# EAGLE design v2 4 button (EAGLE 9.6.2)
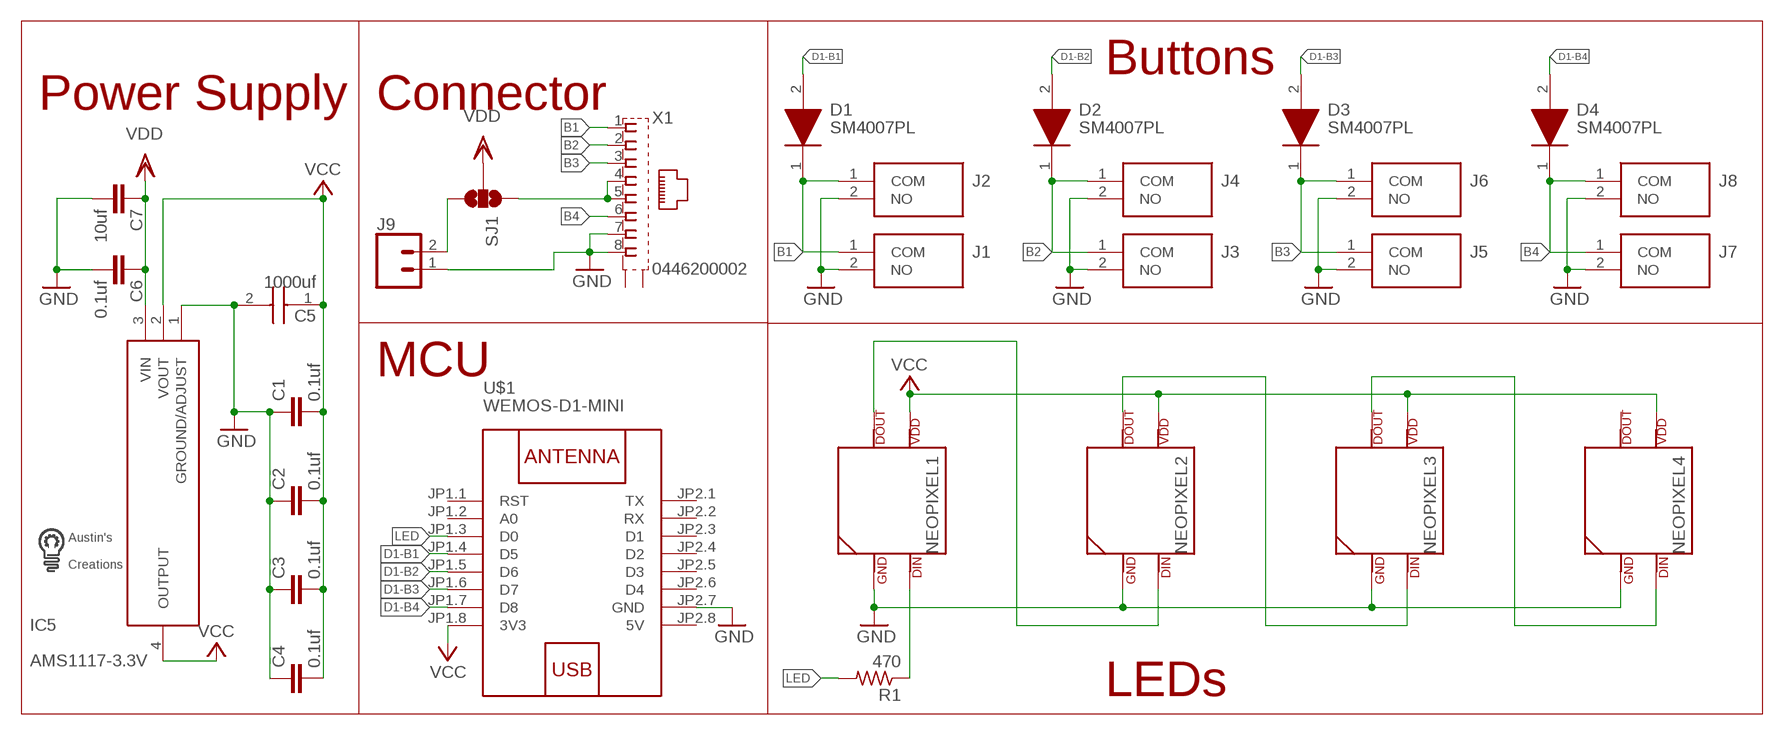
[diagram p0: schematic, sheet 1]

## Parts
C1  0.1uf  C-EUC0603  [C0603]
C2  0.1uf  C-EUC0603  [C0603]
C3  0.1uf  C-EUC0603  [C0603]
C4  0.1uf  C-EUC0603  [C0603]
C5  1000uf  EEE-0JA102P  [CAPAE1030X1050N]
C6  0.1uf  C-EUC0603  [C0603]
C7  10uf  C-EUC0603  [C0603]
D1  SM4007PL  [SODFL3718X125N]
D2  SM4007PL  [SODFL3718X125N]
D3  SM4007PL  [SODFL3718X125N]
D4  SM4007PL  [SODFL3718X125N]
IC5  AMS1117-3.3V  [SOT229P700X180-4N]
J1  PTS636_SM25F_SMTR_LFS  [PTS636SM25FSMTRLFS]
J2  PTS636_SM25F_SMTR_LFS  [PTS636SM25FSMTRLFS]
J3  PTS636_SM25F_SMTR_LFS  [PTS636SM25FSMTRLFS]
J4  PTS636_SM25F_SMTR_LFS  [PTS636SM25FSMTRLFS]
J5  PTS636_SM25F_SMTR_LFS  [PTS636SM25FSMTRLFS]
J6  PTS636_SM25F_SMTR_LFS  [PTS636SM25FSMTRLFS]
J7  PTS636_SM25F_SMTR_LFS  [PTS636SM25FSMTRLFS]
J8  PTS636_SM25F_SMTR_LFS  [PTS636SM25FSMTRLFS]
J9  CONN_025MM  [SCREWTERMINAL-5MM-2]
NEOPIXEL1  SK6812NEOPIXEL5050  [SK6812]
NEOPIXEL2  SK6812NEOPIXEL5050  [SK6812]
NEOPIXEL3  SK6812NEOPIXEL5050  [SK6812]
NEOPIXEL4  SK6812NEOPIXEL5050  [SK6812]
R1  470  R-US_R0603  [R0603]
SJ1  SOLDERJUMPER_2WAYPASTE1&2  [SJ_3_PASTE1&2]
U$1  WEMOS-D1-MINI  [WEMOS-D1-MINI]
U$2  LOGO  [LOGO]
X1  0446200002  [0446200002]

## Nets
B1: D1.1(K) J1.1(COM) J2.1(COM) X1.1
B2: D2.1(K) J3.1(COM) J4.1(COM) X1.2
B3: D3.1(K) J5.1(COM) J6.1(COM) X1.3
B4: D4.1(K) J7.1(COM) J8.1(COM) X1.6
D1-B1: D1.2(A) U$1.JP1.4(D5)
D1-B2: D2.2(A) U$1.JP1.5(D6)
D1-B3: D3.2(A) U$1.JP1.6(D7)
D1-B4: D4.2(A) U$1.JP1.7(D8)
GND: C1.1 C2.1 C3.1 C4.1 C5.2(-) C6.2 C7.2 IC5.1(GROUND/ADJUST) J1.2(NO) J2.2(NO) J3.2(NO) J4.2(NO) J5.2(NO) J6.2(NO) J7.2(NO) J8.2(NO) J9.1 NEOPIXEL1.3(GND) NEOPIXEL2.3(GND) NEOPIXEL3.3(GND) NEOPIXEL4.3(GND) U$1.JP2.7(GND) X1.7 X1.8
LED: R1.2 U$1.JP1.3(D0)
N$1: NEOPIXEL1.2(DOUT) NEOPIXEL2.4(DIN)
N$2: NEOPIXEL2.2(DOUT) NEOPIXEL3.4(DIN)
N$3: NEOPIXEL3.2(DOUT) NEOPIXEL4.4(DIN)
N$4: SJ1.1 X1.4 X1.5
N$5: NEOPIXEL1.4(DIN) R1.1
N$6: J9.2 SJ1.3
VCC: C1.2 C2.2 C3.2 C4.2 C5.1(+) IC5.2(VOUT) IC5.4(OUTPUT) NEOPIXEL1.1(VDD) NEOPIXEL2.1(VDD) NEOPIXEL3.1(VDD) NEOPIXEL4.1(VDD) U$1.JP1.8(3V3)
VDD: C6.1 C7.1 IC5.3(VIN) SJ1.2
Unconnected: NEOPIXEL4.2(DOUT) U$1.JP1.1(RST) U$1.JP1.2(A0) U$1.JP2.1(TX) U$1.JP2.2(RX) U$1.JP2.3(D1) U$1.JP2.4(D2) U$1.JP2.5(D3) U$1.JP2.6(D4) X1.S@1(S1) X1.S@2(S2)

## Notes on the sheet
- Buttons
- Power Supply | Connector
- MCU
- LEDs

## Power pins joined to a net without a drawn wire
5V: U$1.JP2.8(5V)

## Library data of the parts
C1-C4 C6 C7 = rcl:C-EU: CAPACITOR, European symbol; SPICEPREFIX: C
C5 = SamacSys_Parts:EEE-0JA102P: Panasonic 1000uF 6.3 V Aluminium Electrolytic Capacitor G, S(V) Series 2000h 10 x 10.2mm Source: Datasheet <https://componentsearchengine.com/Datasheets/1/EEE-0JA102P.pdf>; DESCRIPTION: Panasonic 1000uF 6.3 V Aluminium Electrolytic Capacitor G, S(V) Series 2000h 10 x 10.2mm; HEIGHT: 10.5mm; MANUFACTURER_NAME: Panasonic; MANUFACTURER_PART_NUMBER: EEE-0JA102P; MOUSER_PART_NUMBER: 667-EEE-0JA102P; MOUSER_PRICE-STOCK: https://www.mouser.com/Search/Refine.aspx?Keyword=667-EEE-0JA102P
D1-D4 = SamacSys_Parts:SM4007PL: 1kV 1A 1.1V @ 1A SOD-123FL Diodes - General Purpose RoHS Source: Datasheet <https://datasheet.lcsc.com/szlcsc/1903051030_MDD-Jiangsu-Yutai-Elec-SM4007PL_C64898.pdf>; DESCRIPTION: 1kV 1A 1.1V @ 1A SOD-123FL Diodes - General Purpose RoHS; HEIGHT: 1.25mm; MANUFACTURER_NAME: MDD(Microdiode Electronics); MANUFACTURER_PART_NUMBER: SM4007PL
IC5 = SamacSys_Parts:AMS1117-3.3V: 1A LOW DROPOUT VOLTAGE REGULATOR, SOT-223 Source: Datasheet <http://www.advanced-monolithic.com/pdf/ds1117.pdf>; DESCRIPTION: 1A LOW DROPOUT VOLTAGE REGULATOR, SOT-223; HEIGHT: 1.8mm; MANUFACTURER_NAME: Advanced Monolithic Systems; MANUFACTURER_PART_NUMBER: ams1117-3.3v
J1-J8 = SamacSys_Parts:PTS636_SM25F_SMTR_LFS: Tactile Switches Tact 50mA 12VDC, 6.0x3.5, 2.5mm H, 180gf, F leads, No ground pin, White Actuator Source: Datasheet <https://ms.componentsearchengine.com/Datasheets/1/PTS636 SM25F SMTR LFS.pdf>; ARROW_PART_NUMBER: PTS636 SM25F SMTR LFS; ARROW_PRICE-STOCK: https://www.arrow.com/en/products/pts636-sm25f-smtr-lfs/ck; DESCRIPTION: Tactile Switches Tact 50mA 12VDC, 6.0x3.5, 2.5mm H, 180gf, F leads, No ground pin, White Actuator; HEIGHT: 2.7mm; MANUFACTURER_NAME: C & K COMPONENTS; MANUFACTURER_PART_NUMBER: PTS636 SM25F SMTR LFS; MOUSER_PART_NUMBER: 611-PTS636SM25FSMTRL; MOUSER_PRICE-STOCK: https://www.mouser.co.uk/ProductDetail/CK/PTS636-SM25F-SMTR-LFS?qs=vLWxofP3U2wcBTQSwfMFOw%3D%3D
J9 = SparkFun-Connectors:CONN_02: Multi connection point. Often used as Generic Header-pin footprint for 0.1 inch spaced/style header connections On any of the 0.1 inch spaced packages, you can populate with these: Break Away Headers - Straight <https://www.sparkfun.com/products/116> (PRT-00116) Break Away Male Headers - Right Angle <https://www.sparkfun.com/products/553> (PRT-00553) Female Headers <https://www.sparkfun.com/products/115> (PRT-00115) Break Away Headers - Machine Pin <https://www.sparkfun.com/products/117> (PRT-00117) Break Away Female Headers - Swiss Machine Pin <https://www.sparkfun.com/products/743> (PRT-00743) For SCREWTERMINALS and SPRING TERMINALS visit here: Screw Terimnals on SparkFun.com <https://www.sparkfun.com/search/results?term=Screw+Terminals> (5mm/3.5mm/2.54mm spacing) This device is also useful as a general connection point to wire up your design to another part of your project. Our various solder wires solder well into these plated through hole pads. Hook-Up Wire - Assortment (Stranded, 22 AWG) <https://www.sparkfun.com/products/11375> (PRT-11375) Hook-Up Wire - Assortment (Solid Core, 22 AWG) <https://www.sparkfun.com/products/11367> (PRT-11367) View the entire wire category on our website here <https://www.sparkfun.com/categories/141> Special notes: Molex polarized connector foot print use with: PRT-08233 with associated crimp pins and housings. 2.54_SCREWTERM for use with PRT-10571. 3.5mm Screw Terminal footprints for PRT-08084 5mm Screw Terminal footprints for use with PRT-08432; SF_SKU: PRT-08432
NEOPIXEL1-NEOPIXEL4 = custom parts:SK6812: for 5050 sk6812 LED
R1 = resistor:R-US_: RESISTOR, American symbol
SJ1 = SparkFun-Retired:SOLDERJUMPER_2WAY: Solder Jumper 2 way solder jumper
U$1 = diy-modules:WEMOS-D1-MINI: WEMOS D1 mini: Mini Wi-Fi Board based on ESP-8266 device More details can be found here: https://www.wemos.cc/product/d1-mini.html Click here to find device on ebay.com <http://www.ebay.com/sch/wemos+d1+mini+nodemcu>
U$2 = custom parts:LOGO
X1 = custom parts:0446200002: RJ-45 INVERTED MODULAR JACK ASSEMBLY WITH RJ-11 KEEPOUT FEATURE Source: Data sheet <http://www.farnell.com/datasheets/73207.pdf> MOLEX 0446200002 BUCHSE, RJ45, GESCHIRMT Source: Farnell <http://de.farnell.com/molex/0446200002/buchse-rj45-geschirmt/dp/9251910?ost=9251910>; MF: MOLEX; MPN: 0446200002; OC_FARNELL: 9251910

## Board
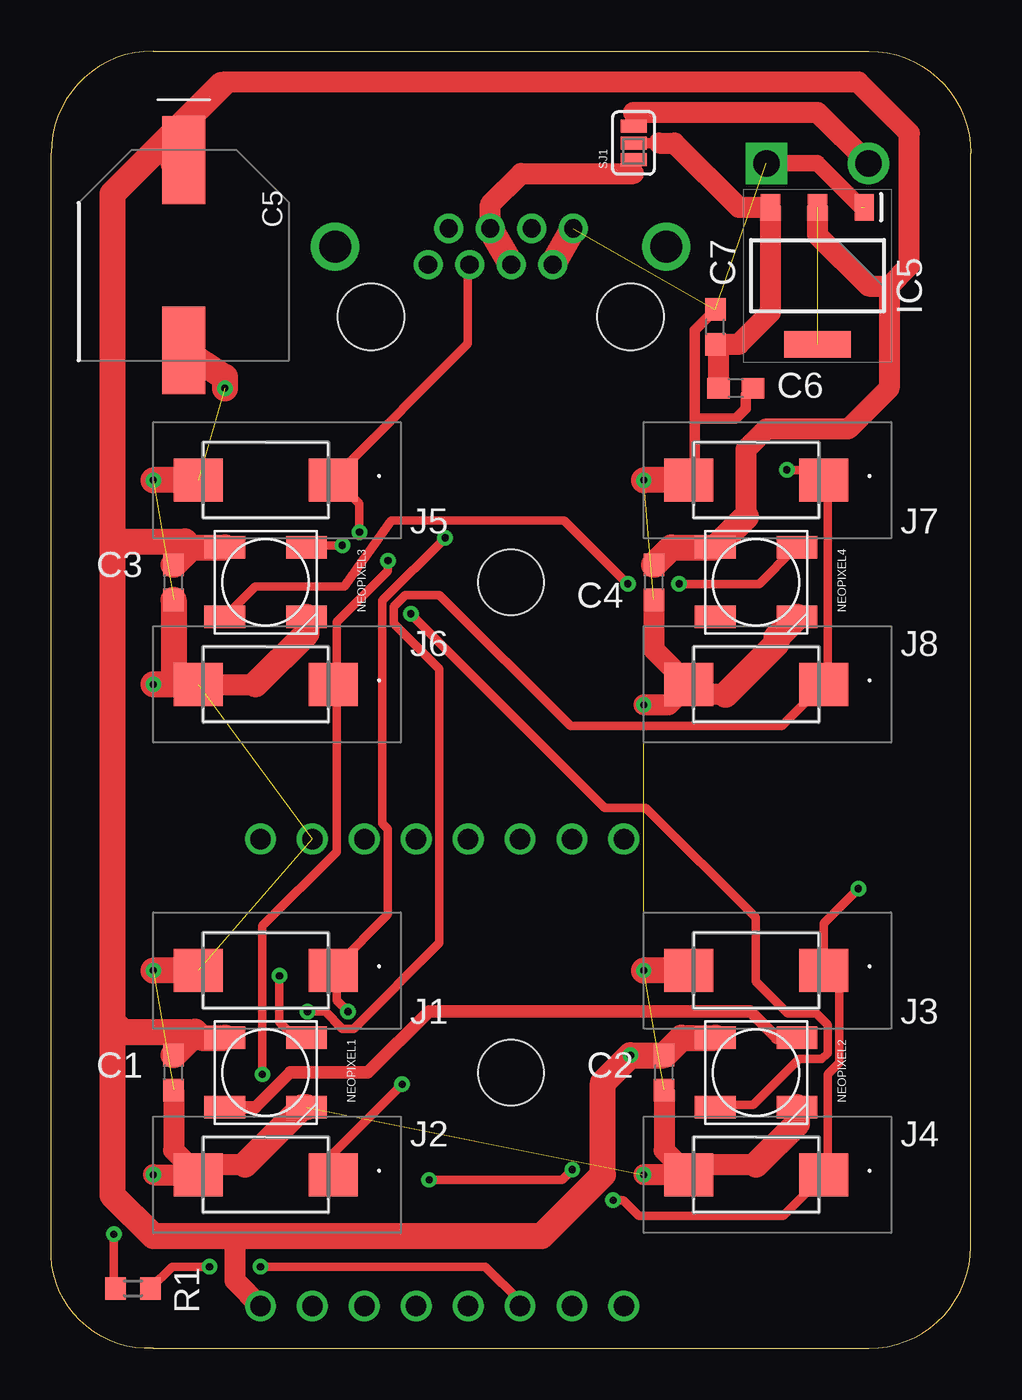
[diagram p1: board, top side]
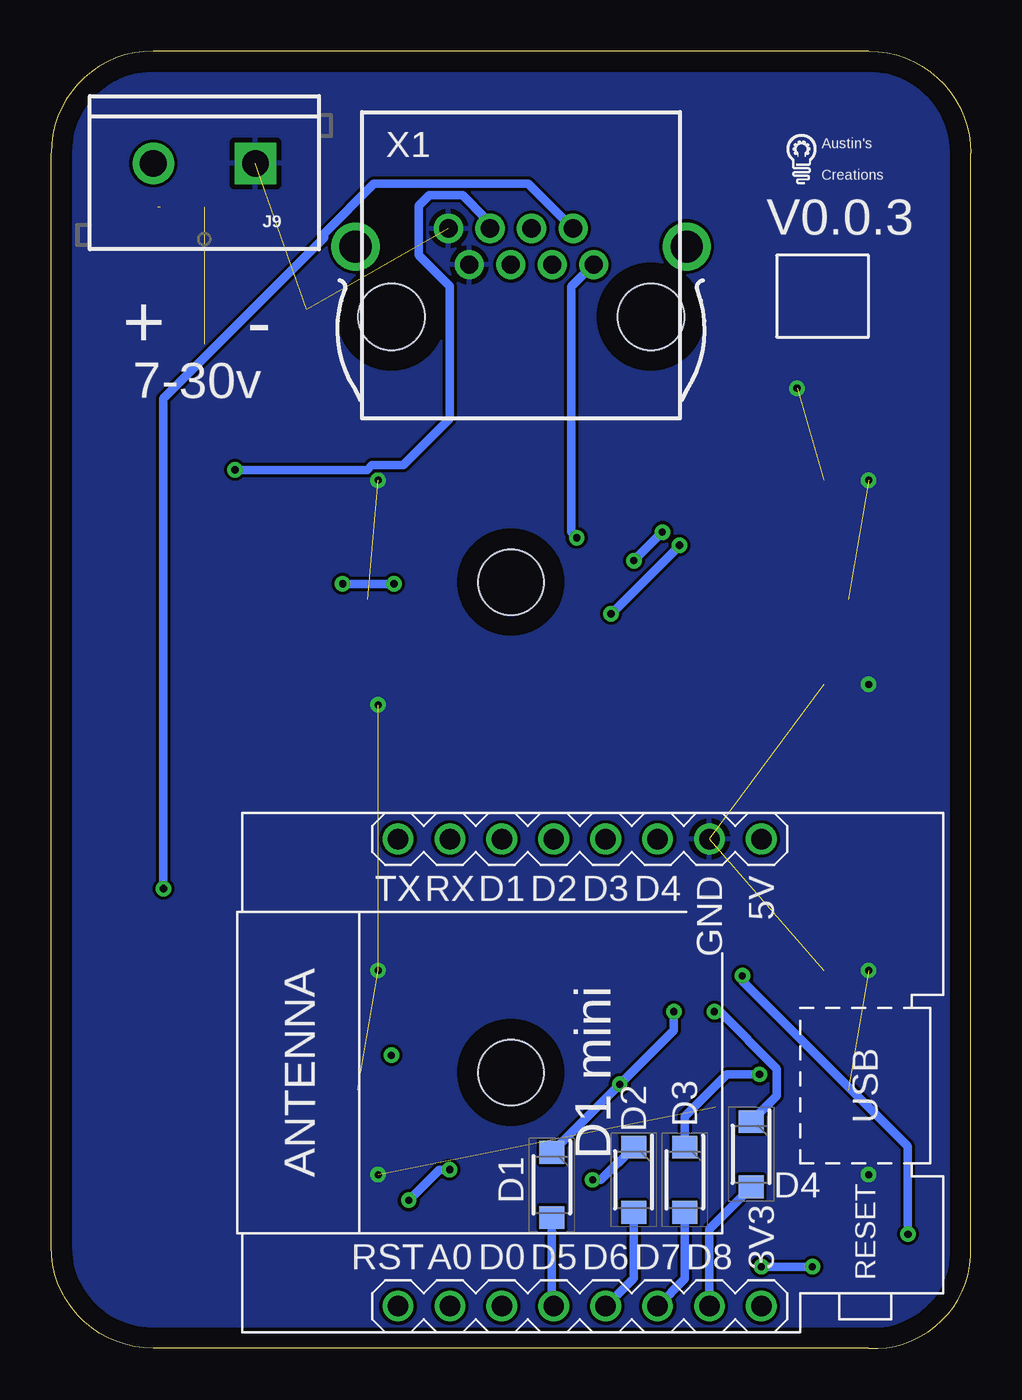
[diagram p2: board, bottom side, seen from below]

Size 45 x 63.5 mm. Coordinates in mm from the lower left corner, seen from the top.
Outline: 0,4.5 0,58.5 arc-90 5,63.5 40,63.5 arc-90 45,58.5 45,5 arc-90 40,0 5,0 arc-90 0,4.5
Copper layers (1*16): Top 0.035mm / dielectric 1.5mm / Bottom 0.035mm
Design rules "default *": minimum track width 16mil, minimum drill 0.35mm, track to track 6mil, track to pad 6mil, pad to pad 6mil, via to via 6mil, smd to smd 6mil, copper to edge 40mil, drill to drill 6mil, minimum pad ring 10mil, minimum via ring 8mil, stop-mask expansion 4mil, vias tented up to drill 0mil, thermal gap 10mil
Holes 3.2 mm at 22.5,37.5 22.5,13.5

### Footprints (pad centres in the part's own frame; a part is rotated, then mirrored left to right if it is on the bottom)
C0603 = smd 1.1 x 1: 1 -0.85,0; 2 0.85,0
CAPAE1030X1050N = smd 4.3 x 2.1: 1 -4.65,0; 2 4.65,0
SODFL3718X125N = smd 1.12 x 1.22: 1 -1.6,0; 2 1.6,0
SOT229P700X180-4N = smd 1.3 x 0.95: 1 -3.35,2.29; 2 -3.35,0; 3 -3.35,-2.29 | smd 1.3 x 3.25: 4 3.35,0
PTS636SM25FSMTRLFS = smd 2.4 x 2.1: 1 -3.3,0; 2 3.3,0
SCREWTERMINAL-5MM-2 = drill 1.3 pad 2.032 square: 1 0,0 | drill 1.3 pad 2.032: 2 5,0
SK6812 = smd 2 x 1.1: 1 -2,1.7; 2 -2,-1.7; 3 2,-1.7; 4 2,1.7
R0603 = smd 1 x 1.1: 1 -0.85,0; 2 0.85,0
SJ_3_PASTE1&2 = smd 0.635 x 1.27: 1 -0.813,0; 2 0,0; 3 0.813,0
WEMOS-D1-MINI = drill 1: JP1.1 -11.43,9.525; JP1.2 -11.43,6.985; JP1.3 -11.43,4.445; JP1.4 -11.43,1.905; JP1.5 -11.43,-0.635; JP1.6 -11.43,-3.175; JP1.7 -11.43,-5.715; JP1.8 -11.43,-8.255; JP2.1 11.43,9.525; JP2.2 11.43,6.985; JP2.3 11.43,4.445; JP2.4 11.43,1.905; JP2.5 11.43,-0.635; JP2.6 11.43,-3.175; JP2.7 11.43,-5.715; JP2.8 11.43,-8.255
0446200002 = drill 0.889 pad 1.422: 1 3.556,2.54; 2 2.54,4.318; 3 1.524,2.54; 4 0.508,4.318; 5 -0.508,2.54; 6 -1.524,4.318; 7 -2.54,2.54; 8 -3.556,4.318 | drill 1.575 pad 2.286: S@1 -8.103,3.429; S@2 8.103,3.429 | hole 3.251: 6.35,0; -6.35,0

### Placement (x,y rotation side)
C1  6,13.5 90 top
C2  30,13.5 90 top
C3  6,37.5 90 top
C4  29.5,37.5 90 top
C5  6.5,53.5 270 top
C6  33.5,47 0 top
C7  32.5,50 90 top
D1  20.5,8 270 bottom
D2  16.5,8.25 270 bottom
D3  14,8.25 270 bottom
D4  10.75,9.5 270 bottom
IC5  37.5,52.5 270 top
J1  10.5,18.5 180 top
J2  10.5,8.5 180 top
J3  34.5,18.5 180 top
J4  34.5,8.5 180 top
J5  10.5,42.5 180 top
J6  10.5,32.5 180 top
J7  34.5,42.5 180 top
J8  34.5,32.5 180 top
J9  35,58 180 bottom
NEOPIXEL1  10.5,13.5 0 top
NEOPIXEL2  34.5,13.5 0 top
NEOPIXEL3  10.5,37.5 0 top
NEOPIXEL4  34.5,37.5 0 top
R1  4.01,2.93 0 top
SJ1  28.5,59 90 top
U$1  18.5,13.5 90 bottom
U$2  9,57 0 bottom
X1  22,50.5 0 bottom

### Tracks (layer width: path | path; a pad name or v marks a point on that pad's centre or on a via)
B1  (via drill 0.35)
  Top 0.406: v14.53,16.49 13.97,17.05 13.97,18.44 J1.1 13.97,18.72 16.48,21.24 16.48,25.43 16.2,25.71 16.2,36.6 v19.28,39.68 | J2.1 13.8,9.55 v17.18,12.93
  Bottom 0.406: v19.28,39.68 19.56,39.96 19.56,51.97 18.72,52.81 X1.1 | v14.53,16.49 14.53,15.57 v17.18,12.93 D1.1
B2  (via drill 0.35)
  Top 0.406: v39.5,22.5 37.8,20.8 J3.1 38,18.44 38.56,17.88 38.56,13.97 38,13.41 38,8.66 J4.1 37.72,8.38 35.84,6.5 28.75,6.5 28,7.25 v27.5,7.25 | v18.5,8.25 25,8.25 v25.5,8.75
  Bottom 0.406: X1.2 21.64,57 29.2,57 31.64,54.57 31.64,54.36 39.5,46.5 v39.5,22.5 | D2.1 18.1,8.25 v18.5,8.25 | v25.5,8.75 26,8.75 v27.5,7.25
B3  (via drill 0.35)
  Top 0.406: v16.48,38.56 16.48,38.06 13.97,35.55 13.97,32.69 J6.1 13.97,32.41 13.97,24.31 10.34,20.68 v10.34,13.41 | v15.09,39.96 15.09,41.35 13.97,42.47 J5.1 13.97,42.75 20.4,49.18 20.4,52.81 X1.3
  Bottom 0.406: v15.09,39.96 v16.48,38.56 | v10.34,13.41 11.94,13.41 14,11.35 D3.1
B4  (via drill 0.35)
  Top 0.406: v12.54,16.49 13.41,16.49 14.25,15.65 14.81,15.65 19,19.84 19,33.25 16.76,35.49 16.76,36.32 17.32,36.88 19,36.88 25.43,30.46 35.76,30.46 37.72,32.41 J8.1 38,32.69 38,42.47 J7.1 37.72,42.75 37.47,43 v36,43
  Bottom 0.406: X1.6 23.75,55.04 23.75,55.32 24.87,56.44 26.5,56.44 27,55.94 27,53.5 25.5,52 25.5,45.5 27.77,43.24 29.3,43.24 29.54,43 v36,43 | v12.54,16.49 12.29,16.49 9.5,13.69 9.5,12.35 D4.1
D1-B1
  Bottom 0.406: D1.2 20.5,2.17 U$1.JP1.4
D1-B2
  Bottom 0.406: D2.2 16.5,3.44 U$1.JP1.5
D1-B3
  Bottom 0.406: D3.2 14,3.4 U$1.JP1.6
D1-B4
  Bottom 0.406: D4.2 11,7.65 11,7.61 12.79,5.82 U$1.JP1.7
GND  (via drill 0.35)  (12 unrouted)
  Top 0.508: C7.2 31.5,49.85 31.5,45.5 | J7.2 31.5,42.8 31.5,45.5 | C6.2 34,46.65 34,46 33.5,45.5 31.5,45.5
  Top 0.813: J9.1 37.5,58 39.65,55.85
  Top 1.016: v5,8.5 J2.2 | C1.1 6,9.7 J2.2 | 33,32 31.7,32 J8.2 | J8.2 30.2,31.5 v29,31.5 | C4.1 29.5,34.2 J8.2 | 10,32.5 J6.2 v5,32.5 | C2.1 30,9.7 J4.2 | J4.2 v29,8.5 | J4.2 31.7,9 34.5,9 | J2.2 7.7,9 9.5,9
  Top 1.27: X1.7 X1.8 | J5.2 v5,42.5 | v5,32.5 6,32.5 C3.1 | J1.2 v5,18.5 | NEOPIXEL1.3 12.3,11.8 9.5,9 | 10,32.5 12.5,35 NEOPIXEL3.3 | J3.2 v29,18.5 | 34.5,9 36.5,11 NEOPIXEL2.3 | J7.2 v29,42.5 | 33,32 35.5,34.5 35.5,34.8 NEOPIXEL4.3 | C5.2 8.5,47.55 v8.5,47
  pour Bottom: 5,63.5 arc90 0,58.5 0,5 arc90 5,0 40,0 arc90 45,5 45,58.5 arc90 40,63.5
LED  (via drill 0.35)
  Top 0.406: R1.2 5.93,4 v7.75,4 | v10.25,4 21.25,4 22.95,2.31 U$1.JP1.3
  Bottom 0.406: v7.75,4 v10.25,4
N$1
  Top 0.61: NEOPIXEL1.2 10,11.8 11.7,13.5 15.5,13.5 18.5,16.5 34.2,16.5 35.5,15.2 NEOPIXEL2.4
N$2  (via drill 0.35)
  Top 0.406: v17.6,35.96 27.1,26.46 29.1,26.46 34.47,21.09 34.47,17.97 36.04,16.4 37.44,16.4 38,15.84 38,14.44 37.72,14.16 36.6,14.16 34.37,11.93 32.69,11.93 NEOPIXEL2.2 | v14.25,39.31 12.57,39.31 NEOPIXEL3.4
  Bottom 0.406: v14.25,39.31 v17.6,35.96
N$3  (via drill 0.35)
  Top 0.406: v28.22,37.43 25.12,40.53 16.65,40.53 14.36,37.3 10,37.3 NEOPIXEL3.2 | v30.73,37.43 34.65,37.43 36.32,39.1 NEOPIXEL4.4
  Bottom 0.406: v30.73,37.43 v28.22,37.43
N$4
  Top 0.508: 28.5,57.5 SJ1.1
  Top 1.016: X1.4 21.5,56 23,57.5 28.5,57.5
  Top 1.27: X1.5 X1.4
N$5  (via drill 0.35)
  Top 0.406: v3.07,5.59 3.07,3.08 R1.1 | v11.18,18.24 11.18,15.99 11.96,15.2 NEOPIXEL1.4
  Bottom 0.406: v3.07,5.59 3.07,9.88 11.18,17.99 v11.18,18.24
N$6
  Top 0.508: SJ1.3 28.5,60.5
  Top 1.016: J9.2 37.5,60.5 28.5,60.5
VCC  (via drill 0.35)  (1 unrouted)
  Top 1.016: U$1.JP1.8 9,3.32 9,5.5 | IC5.2 37.5,54.5 40,52 41,52 | 41,52 41,47 39,45 35,45 34,44 34,40.7 | 41,52 42,53 42,59.48 39.5,61.98 8.48,61.98 8.35,61.85
  Top 1.27: 6,59.5 6,58 6.04,58.15 C5.1 | C1.2 7.1,15.45 | NEOPIXEL1.1 7.35,15.2 7.1,15.45 | C4.2 30.35,39.2 NEOPIXEL4.1 34,40.7 | C3.2 6.85,39.2 | 6.85,39.2 NEOPIXEL3.1 | NEOPIXEL2.1 30.85,15.2 C2.2 v28.35,14.35 27,13 27,8.5 24,5.5 9,5.5 5,5.5 3,7.5 3,16 | 6.85,39.2 6.55,39.5 3,39.5 | 7.1,15.45 7.05,15.5 3.5,15.5 3,16 | 8.35,61.85 6,59.5 | 6,59.5 3,56.5 3,39.5 | 3,39.5 3,16
VDD
  Top 0.508: SJ1.2 29.75,59
  Top 1.016: 29.75,59 30.5,59 33.65,55.85 IC5.3 35.21,50.71 33.65,49.15 C7.1 32.65,49 C6.1

### Text on the board
bPlace: V0.0.3 | + - | 7-30v